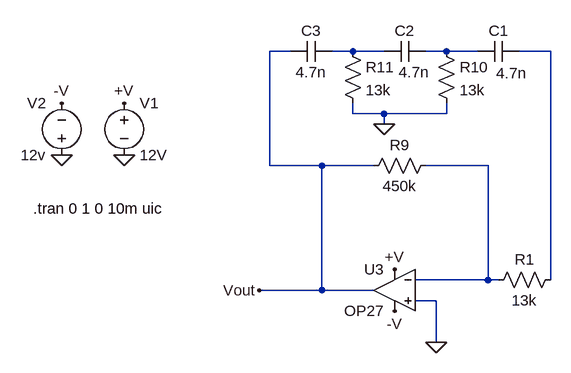
[diagram p0: schematic Oscillator.asc]
Oscillator.asc, the LTspice schematic file:
Version 4
SHEET 1 3796 1152
WIRE 1760 -256 1728 -256
WIRE 1856 -256 1824 -256
WIRE 1904 -256 1856 -256
WIRE 2000 -256 1968 -256
WIRE 2048 -256 2000 -256
WIRE 2160 -256 2112 -256
WIRE 1856 -160 1856 -176
WIRE 1904 -160 1856 -160
WIRE 2000 -160 2000 -176
WIRE 2000 -160 1904 -160
WIRE 1904 -144 1904 -160
WIRE 1728 -80 1728 -256
WIRE 1808 -80 1728 -80
WIRE 1888 -80 1808 -80
WIRE 2064 -80 1968 -80
WIRE 2064 96 2064 -80
WIRE 2064 96 1952 96
WIRE 2080 96 2064 96
WIRE 2160 96 2160 -256
WIRE 1808 112 1808 -80
WIRE 1808 112 1712 112
WIRE 1888 112 1808 112
WIRE 1984 128 1952 128
WIRE 1984 192 1984 128
FLAG 1504 -96 0
FLAG 1504 -176 +V
FLAG 1408 -96 0
FLAG 1408 -176 -V
FLAG 1920 80 +V
FLAG 1920 144 -V
FLAG 1712 112 Vout
FLAG 1984 192 0
FLAG 1904 -144 0
SYMBOL voltage 1504 -192 R0
WINDOW 123 0 0 Left 0
WINDOW 39 0 0 Left 0
SYMATTR InstName V1
SYMATTR Value 12V
SYMBOL voltage 1408 -80 R180
WINDOW 0 24 96 Left 2
WINDOW 3 24 16 Left 2
WINDOW 123 0 0 Left 0
WINDOW 39 0 0 Left 0
SYMATTR InstName V2
SYMATTR Value 12v
SYMBOL res 2064 112 R270
WINDOW 0 32 56 VTop 2
WINDOW 3 0 56 VBottom 2
SYMATTR InstName R1
SYMATTR Value 13k
SYMBOL Opamps\\OP27 1920 48 M0
SYMATTR InstName U3
SYMBOL res 1984 -96 R90
WINDOW 0 0 56 VBottom 2
WINDOW 3 32 56 VTop 2
SYMATTR InstName R9
SYMATTR Value 450k
SYMBOL cap 2112 -272 R90
WINDOW 0 0 32 VBottom 2
WINDOW 3 34 12 VTop 2
SYMATTR InstName C1
SYMATTR Value 4.7n
SYMBOL res 1984 -272 R0
SYMATTR InstName R10
SYMATTR Value 13k
SYMBOL cap 1968 -272 R90
WINDOW 0 0 32 VBottom 2
WINDOW 3 32 18 VTop 2
SYMATTR InstName C2
SYMATTR Value 4.7n
SYMBOL res 1840 -272 R0
SYMATTR InstName R11
SYMATTR Value 13k
SYMBOL cap 1824 -272 R90
WINDOW 0 0 32 VBottom 2
WINDOW 3 32 32 VTop 2
SYMATTR InstName C3
SYMATTR Value 4.7n
TEXT 1364 -14 Left 2 !.tran 0 1 0 10m uic

The netlist it stands for:
* Oscillator.asc
V1 +V 0 12V
V2 0 -V 12v
R1 N004 N003 13k
XU3 0 N004 +V -V Vout OP27  ; pins In+ In- V+ V- OUT
R9 N004 Vout 450k
C1 N003 N002 4.7n
R10 N002 0 13k
C2 N002 N001 4.7n
R11 N001 0 13k
C3 N001 Vout 4.7n
.tran 0 1 0 10m uic
.lib ADI.lib
.backanno
.end